# Altium schematic sheet ZigBee.SchDoc
size A4
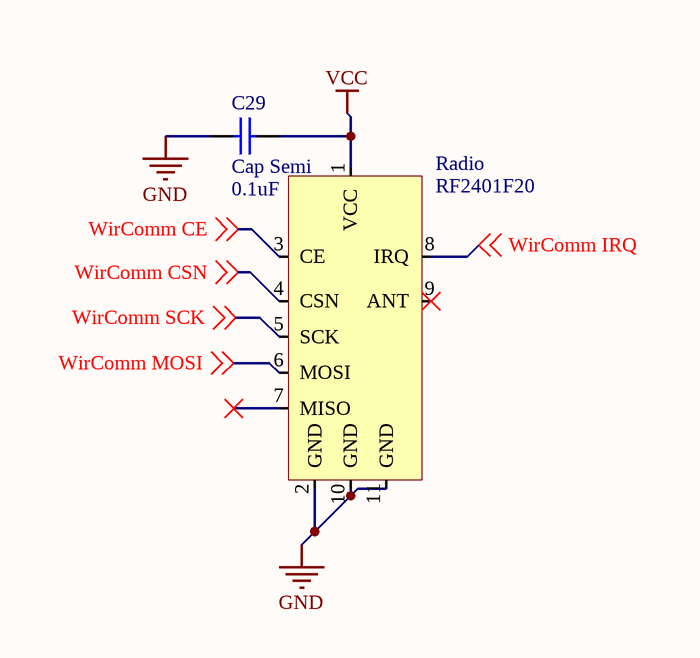
[diagram p0: ZigBee.SchDoc]

## Parts
C29  Cap Semi  value 0.1uF  [1608[0603]]
Radio  RF2401F20  [RF2401F20]

## Nets
GND: C29.2 Radio.2(GND) Radio.10(GND) Radio.11(GND)
VCC: C29.1 Radio.1(VCC)
WirComm CE: Radio.3(CE) ; off-sheet WirComm CE
WirComm CSN: Radio.4(CSN) ; off-sheet WirComm CSN
WirComm IRQ: Radio.8(IRQ) ; off-sheet WirComm IRQ
WirComm MOSI: Radio.6(MOSI) ; off-sheet WirComm MOSI
WirComm SCK: Radio.5(SCK) ; off-sheet WirComm SCK

Not connected (* = marked no-connect by the designer): Radio 7(MISO)* 9(ANT)*

## Library data of the parts
C29 = Cap Semi: Capacitor (Semiconductor SIM Model); Published: 8-Jun-2000; LatestRevisionDate: 29-May-2009; LatestRevisionNote: IPC-7351 Footprint Added.; PackageReference: C1206; Publisher: Altium Limited; PackageDescription: Chip Capacitor